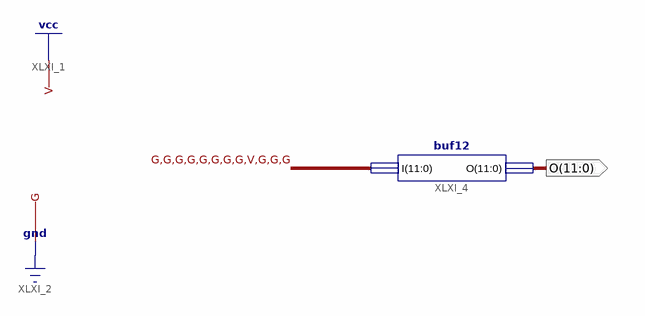
[diagram p0: schematic sheet 1]
// Xilinx ISE schematic constant8twelvebit.sch (spartan3adsp) as structural Verilog: 1 symbols, 1 ports
module constant8twelvebit (
  output [11:0] O
);

  buf12 XLXI_4 (.I(12'b000000001000), .O(O));
endmodule
